# EAGLE design facetHound_inputs_mast_v13 (EAGLE 9.6.2)

## Sheet 1 of 2
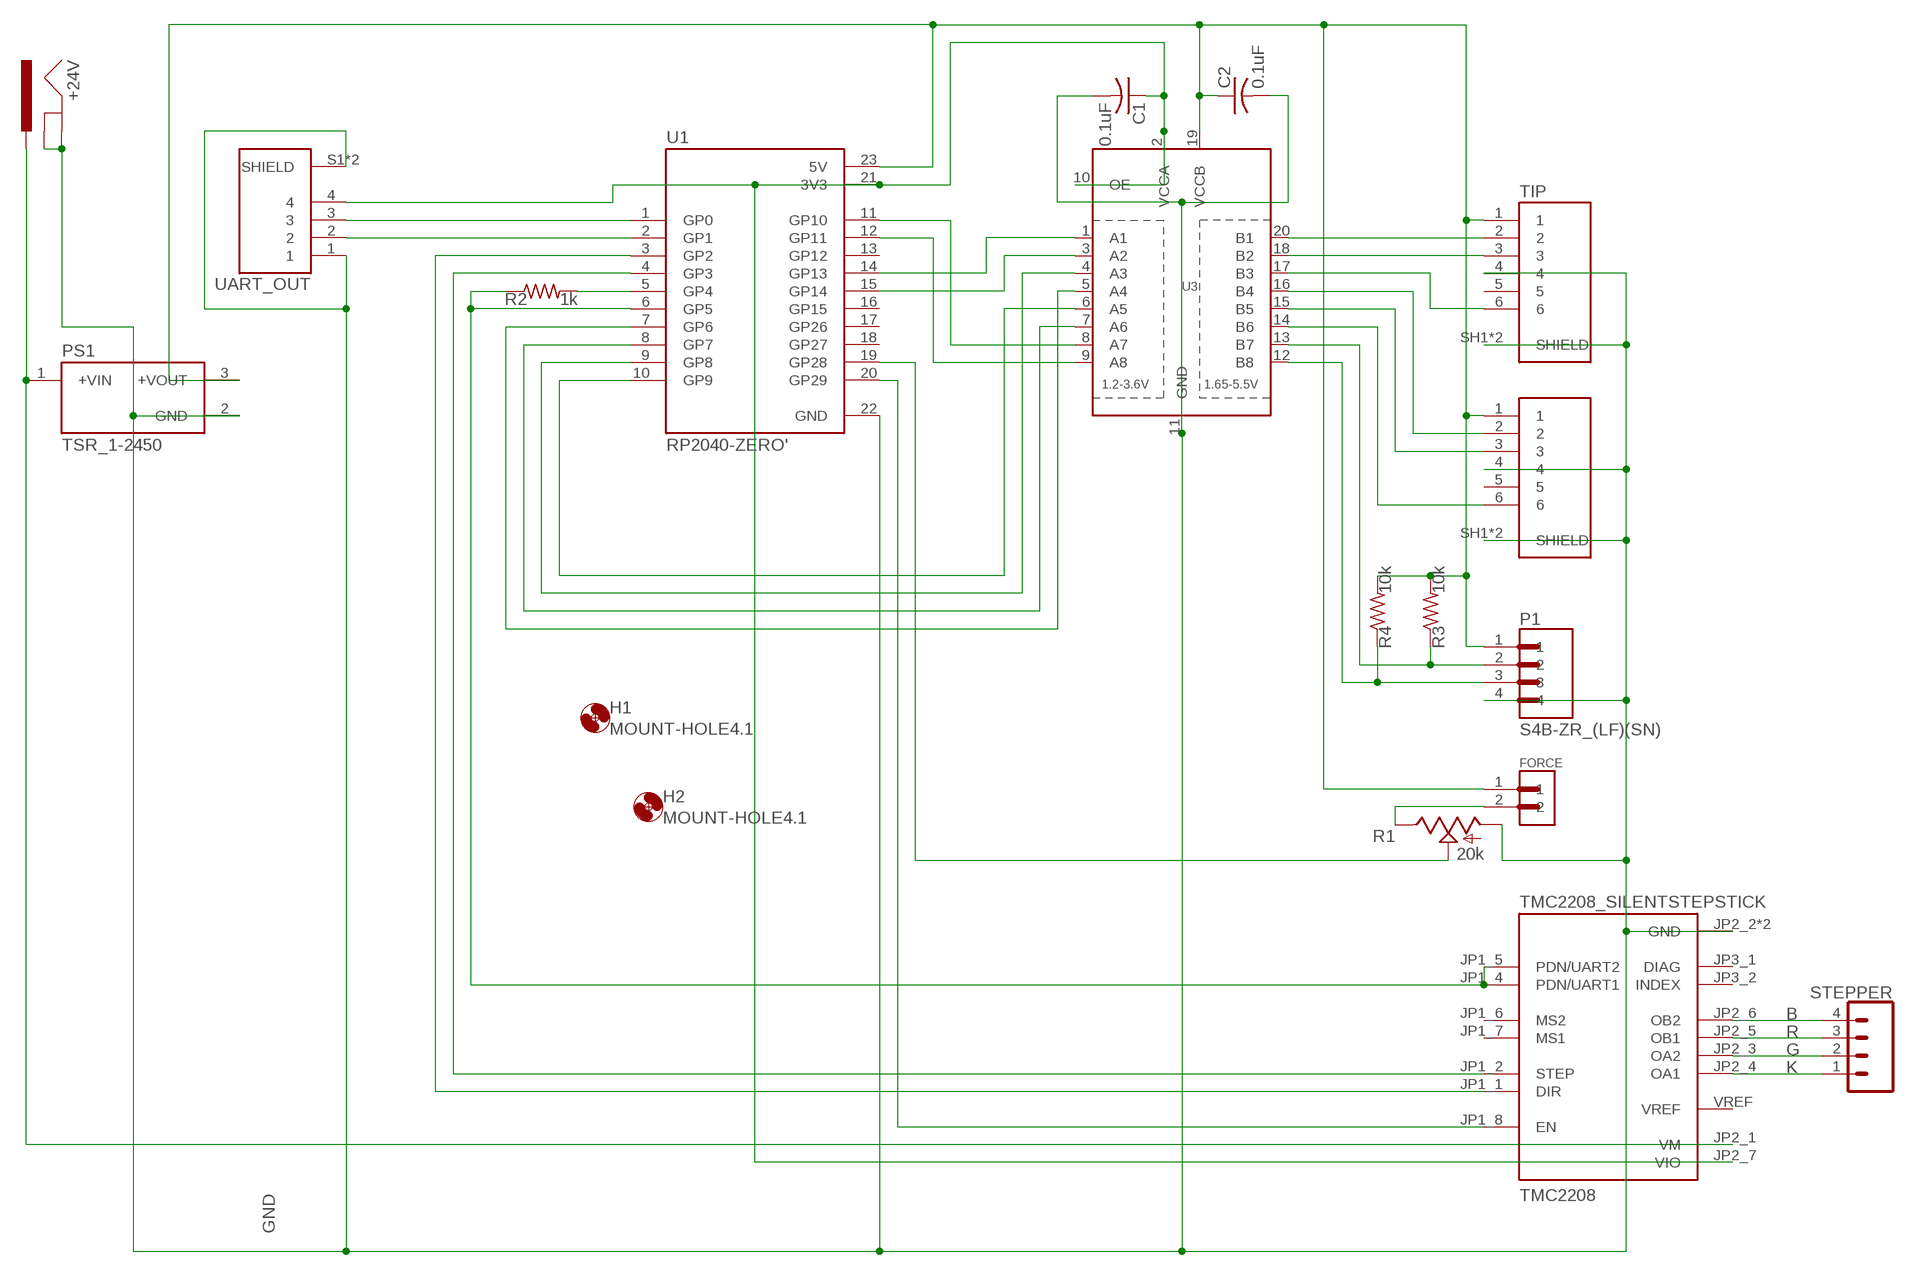
[diagram p0: schematic, sheet 1]

### Parts
+24V  POWER_JACKPOWER_JACK_SLOT  [POWER_JACK_PTH_SLOT]
C1  0.1uF  C-USC1206  [C1206]
C2  0.1uF  C-USC1206  [C1206]
FORCE  S2B-ZR-SM4A-TF  [JST_S2B-ZR-SM4A-TF]
H1  MOUNT-HOLE4.1  [4,1]
H2  MOUNT-HOLE4.1  [4,1]
P1  S4B-ZR_(LF)(SN)  [JST_S4B-ZR(LF)(SN)]
PS1  TSR_1-2450  [CONV_TSR_1-2450]
R1  20k  TRIM_US-RJ9W  [RJ9W]
R2  1k  R-US_R1206  [R1206]
R3  10k  R-US_R1206  [R1206]
R4  10k  R-US_R1206  [R1206]
STEPPER  CONN_04JST-PTH  [JST-4-PTH]
TILT  S6B-ZR-SM4A-TF(LF)(SN)  [JST_S6B-ZR-SM4A-TF(LF)(SN)]
TIP  S6B-ZR-SM4A-TF(LF)(SN)  [JST_S6B-ZR-SM4A-TF(LF)(SN)]
TMC2208  TMC2208_SILENTSTEPSTICK  [MODULE_TMC2208_SILENTSTEPSTICK]
U1  RP2040-ZERO'  [MODULE_RP2040-ZERO]
U3  TXB0108PWR  [TSSOP20]
UART_OUT  S4B-ZR-SM4A-TF(LF)(SN)  [JST_S4B-ZR-SM4A-TF(LF)(SN)]

### Nets
B: STEPPER.4 TMC2208.JP2_6(OB2)
G: STEPPER.2 TMC2208.JP2_3(OA2)
GND: +24V.GND +24V.GNDBREAK C1.2 C2.2 P1.4 PS1.2(GND) R1.A TILT.4 TILT.SH1(SHIELD) TILT.SH2(SHIELD) TIP.4 TIP.SH1(SHIELD) TIP.SH2(SHIELD) TMC2208.JP2_2(GND) TMC2208.JP2_8(GND) U1.22(GND) U3.11(GND) UART_OUT.1 UART_OUT.S1(SHIELD) UART_OUT.S2(SHIELD)
K: STEPPER.1 TMC2208.JP2_4(OA1)
N$1: R2.1 TMC2208.JP1_4(PDN/UART1) TMC2208.JP1_5(PDN/UART2) U1.6(GP5)
N$2: C1.1 TMC2208.JP2_7(VIO) U1.21(3V3) U3.2(VCCA) U3.10(OE) UART_OUT.4
N$3: R2.2 U1.5(GP4)
N$4: TMC2208.JP1_2(STEP) U1.4(GP3)
N$5: TMC2208.JP1_1(DIR) U1.3(GP2)
N$6: C2.1 FORCE.1 P1.1 PS1.3(+VOUT) R3.2 R4.2 TILT.1 TIP.1 U1.23(5V) U3.19(VCCB)
N$7: R1.S U1.19(GP28)
N$8: TIP.2 U3.20(B1)
N$10: U1.2(GP1) UART_OUT.2
N$11: U1.1(GP0) UART_OUT.3
N$12: TIP.3 U3.18(B2)
N$13: TIP.6 U3.17(B3)
N$14: TILT.2 U3.16(B4)
N$15: TILT.3 U3.15(B5)
N$16: TILT.6 U3.14(B6)
N$17: P1.2 R3.1 U3.13(B7)
N$18: P1.3 R4.1 U3.12(B8)
N$20: TMC2208.JP1_8(EN) U1.20(GP29)
N$21: +24V.PWR PS1.1(+VIN) TMC2208.JP2_1(VM)
N$23: U1.14(GP13) U3.1(A1)
N$24: FORCE.2 R1.E
N$25: U1.15(GP14) U3.3(A2)
N$26: U1.9(GP8) U3.4(A3)
N$27: U1.7(GP6) U3.5(A4)
N$28: U1.10(GP9) U3.6(A5)
N$29: U1.8(GP7) U3.7(A6)
N$30: U1.12(GP11) U3.9(A8)
N$31: U1.11(GP10) U3.8(A7)
R: STEPPER.3 TMC2208.JP2_5(OB1)
Unconnected: TILT.5 TIP.5 TMC2208.JP1_6(MS2) TMC2208.JP1_7(MS1) TMC2208.JP3_1(DIAG) TMC2208.JP3_2(INDEX) TMC2208.VREF U1.13(GP12) U1.16(GP15) U1.17(GP26) U1.18(GP27)

## Sheet 2 of 2

## Library data of the parts
+24V = SparkFun-Connectors:POWER_JACK: Power Jack Connector This is the standard 5.5mm barrel jack for power. The PTH is the most common, proven, reliable, footprint. The Slot footprint only works if the mill layer is transmitted to the PCB fab house so be warned. Here are the connectors we sell at SparkFun: DC Barrel Power Jack/Connector <https://www.sparkfun.com/products/119> (PRT-00119) DC Barrel Power Jack/Connector (SMD) <https://www.sparkfun.com/products/12748> (PRT-12748) DC Barrel Jack Adapter - Breadboard Compatible <https://www.sparkfun.com/products/10811> (PRT-10811) It is used on this SparkFun product (and many, many others): SparkFun RedBoard - Programmed with Arduino <https://www.sparkfun.com/products/12757> (DEV-12757) Also, if you need a mating power supply or connector, please check these out: Wall Adapter Power Supply - 9VDC 650mA <https://www.sparkfun.com/products/298> (TOL-00298) DC Barrel Jack Adapter - Male <https://www.sparkfun.com/products/10287> (PRT-10287); PROD_ID: CONN-08197
C1 C2 = adafruit:C-US: CAPACITOR, American symbol
FORCE = S2B-ZR-SM4A-TF:S2B-ZR-SM4A-TF: Check availability <https://pricing.snapeda.com/parts/S2B-ZR-SM4A-TF/JST%20Sales/view-part?ref=eda>; AVAILABILITY: In Stock; CHECK_PRICES: https://www.snapeda.com/parts/S2B-ZR-SM4A-TF/JST/view-part/?ref=eda; DESCRIPTION: Connector Header Surface Mount, Right Angle 2 position 0.059 (1.50mm); MF: JST Sales; MP: S2B-ZR-SM4A-TF; PACKAGE: None; PRICE: None; SNAPEDA_LINK: https://www.snapeda.com/parts/S2B-ZR-SM4A-TF/JST/view-part/?ref=snap
H1 H2 = holes:MOUNT-HOLE: MOUNTING HOLE with drill center marker
P1 = S4B-ZR__LF__SN_:S4B-ZR_(LF)(SN): Check availability <https://pricing.snapeda.com/parts/S4B-ZR%20%28LF%29%28SN%29/JST%20Sales/view-part?ref=eda>; AVAILABILITY: In Stock; CHECK_PRICES: https://www.snapeda.com/parts/S4B-ZR%20(LF)(SN)/JST/view-part/?ref=eda; DESCRIPTION: Connector Header Surface Mount, Right Angle 4 position 0.059 (1.50mm); MF: JST Sales; MP: S4B-ZR (LF)(SN); PACKAGE: None; PRICE: None; SNAPEDA_LINK: https://www.snapeda.com/parts/S4B-ZR%20(LF)(SN)/JST/view-part/?ref=snap
PS1 = TSR_1-2450:TSR_1-2450; MANUFACTURER: Traco Power; MAXIMUM_PACKAGE_HEIGHT: 10.6mm; PARTREV: Apr 27, 2020; STANDARD: Manufacturer Recommendations
R1 = pot:TRIM_US-: POTENTIOMETER
R2-R4 = adafruit:R-US_: RESISTOR, American symbol
STEPPER = SparkFun-Connectors:CONN_04: Multi connection point. Often used as Generic Header-pin footprint for 0.1 inch spaced/style header connections On any of the 0.1 inch spaced packages, you can populate with these: Break Away Headers - Straight <https://www.sparkfun.com/products/116> (PRT-00116) Break Away Male Headers - Right Angle <https://www.sparkfun.com/products/553> (PRT-00553) Female Headers <https://www.sparkfun.com/products/115> (PRT-00115) Break Away Headers - Machine Pin <https://www.sparkfun.com/products/117> (PRT-00117) Break Away Female Headers - Swiss Machine Pin <https://www.sparkfun.com/products/743> (PRT-00743) For SCREWTERMINALS and SPRING TERMINALS visit here: Screw Terimnals on SparkFun.com <https://www.sparkfun.com/search/results?term=Screw+Terminals> (5mm/3.5mm/2.54mm spacing) This device is also useful as a general connection point to wire up your design to another part of your project. Our various solder wires solder well into these plated through hole pads. Hook-Up Wire - Assortment (Stranded, 22 AWG) <https://www.sparkfun.com/products/11375> (PRT-11375) Hook-Up Wire - Assortment (Solid Core, 22 AWG) <https://www.sparkfun.com/products/11367> (PRT-11367) View the entire wire category on our website here <https://www.sparkfun.com/categories/141> Special notes: Molex polarized connector foot print use with SKU : PRT-08231 with associated crimp pins and housings. 1MM SMD Version SKU: PRT-10208; PROD_ID: WIRE-13531; SF_ID: PRT-09916
TILT TIP = S6B-ZR-SM4A-TF_LF__SN_:S6B-ZR-SM4A-TF(LF)(SN): Check availability <https://pricing.snapeda.com/parts/S6B-ZR-SM4A-TF%28LF%29%28SN%29/JST%20Sales%20America%20Inc./view-part?ref=eda>; AVAILABILITY: In Stock; CHECK_PRICES: https://www.snapeda.com/parts/S6B-ZR-SM4A-TF(LF)(SN)/JST/view-part/?ref=eda; DESCRIPTION: Connector Header Surface Mount, Right Angle 6 position 0.059 (1.50mm); MF: JST Sales America Inc.; MP: S6B-ZR-SM4A-TF(LF)(SN); PACKAGE: None; PRICE: None; SNAPEDA_LINK: https://www.snapeda.com/parts/S6B-ZR-SM4A-TF(LF)(SN)/JST/view-part/?ref=snap
TMC2208 = TMC2208_SILENTSTEPSTICK:TMC2208_SILENTSTEPSTICK: Check availability <https://pricing.snapeda.com/parts/TMC2208%20SILENTSTEPSTICK/Trinamic%20Motion/view-part?ref=eda>; AVAILABILITY: In Stock; CHECK_PRICES: https://www.snapeda.com/parts/TMC2208%20SILENTSTEPSTICK/Trinamic/view-part/?ref=eda; DESCRIPTION: TMC2208 Motor Controller/Driver, Stepper Power Management Evaluation Board; MF: Trinamic Motion; MP: TMC2208 SILENTSTEPSTICK; PACKAGE: None; PRICE: None; SNAPEDA_LINK: https://www.snapeda.com/parts/TMC2208%20SILENTSTEPSTICK/Trinamic/view-part/?ref=snap
U1 = RP2040-ZERO:RP2040-ZERO: Check availability <https://pricing.snapeda.com/parts/RP2040-ZERO/Waveshare%20Electronics/view-part?ref=eda>; AVAILABILITY: Not in stock; CHECK_PRICES: https://www.snapeda.com/parts/RP2040-ZERO/Waveshare+Electronics/view-part/?ref=eda; DESCRIPTION: Low-Cost, High-Performance Pico-Like MCU Board Based On Raspberry Pi Microcontroller RP2040; MF: Waveshare Electronics; MP: RP2040-ZERO; PACKAGE: Package; PRICE: None; SNAPEDA_LINK: https://www.snapeda.com/parts/RP2040-ZERO/Waveshare+Electronics/view-part/?ref=snap
U3 = adafruit:TXB0108PWR: 8-Bit Bi-Directional Level Shifter 1.2V-3.6V (VCCA) to 1.65V-5.5V (VCCB) bi-directional level shifter with auto direction sensing. Max data rate - VCCA 1.8V: 20Mbps (50ns), VCCA 3.3V: 100Mbps (10ns) Digikey: 296-21527-1-ND
UART_OUT = S4B-ZR-SM4A-TF_LF__SN_:S4B-ZR-SM4A-TF(LF)(SN): Check availability <https://pricing.snapeda.com/parts/S4B-ZR-SM4A-TF%28LF%29%28SN%29/JST%20Sales/view-part?ref=eda>; AVAILABILITY: In Stock; CHECK_PRICES: https://www.snapeda.com/parts/S4B-ZR-SM4A-TF(LF)(SN)/JST/view-part/?ref=eda; DESCRIPTION: Connector Header Surface Mount, Right Angle 4 position 0.059 (1.50mm); MF: JST Sales; MP: S4B-ZR-SM4A-TF(LF)(SN); PACKAGE: None; PRICE: None; SNAPEDA_LINK: https://www.snapeda.com/parts/S4B-ZR-SM4A-TF(LF)(SN)/JST/view-part/?ref=snap

## Board
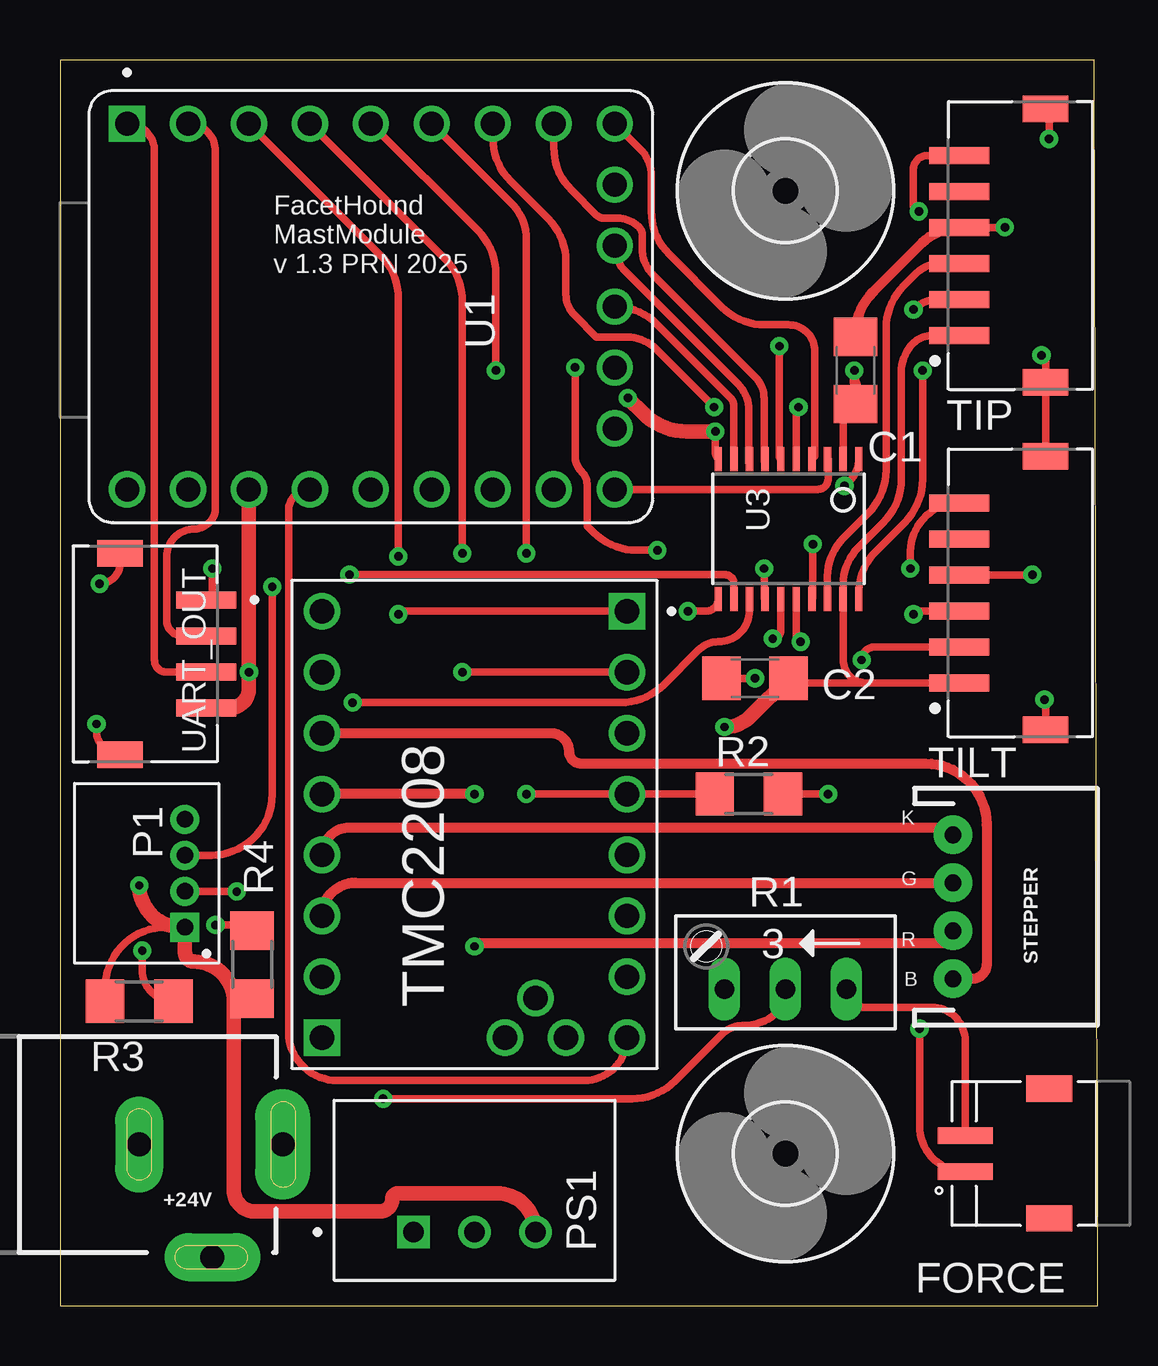
[diagram p1: board, top side]
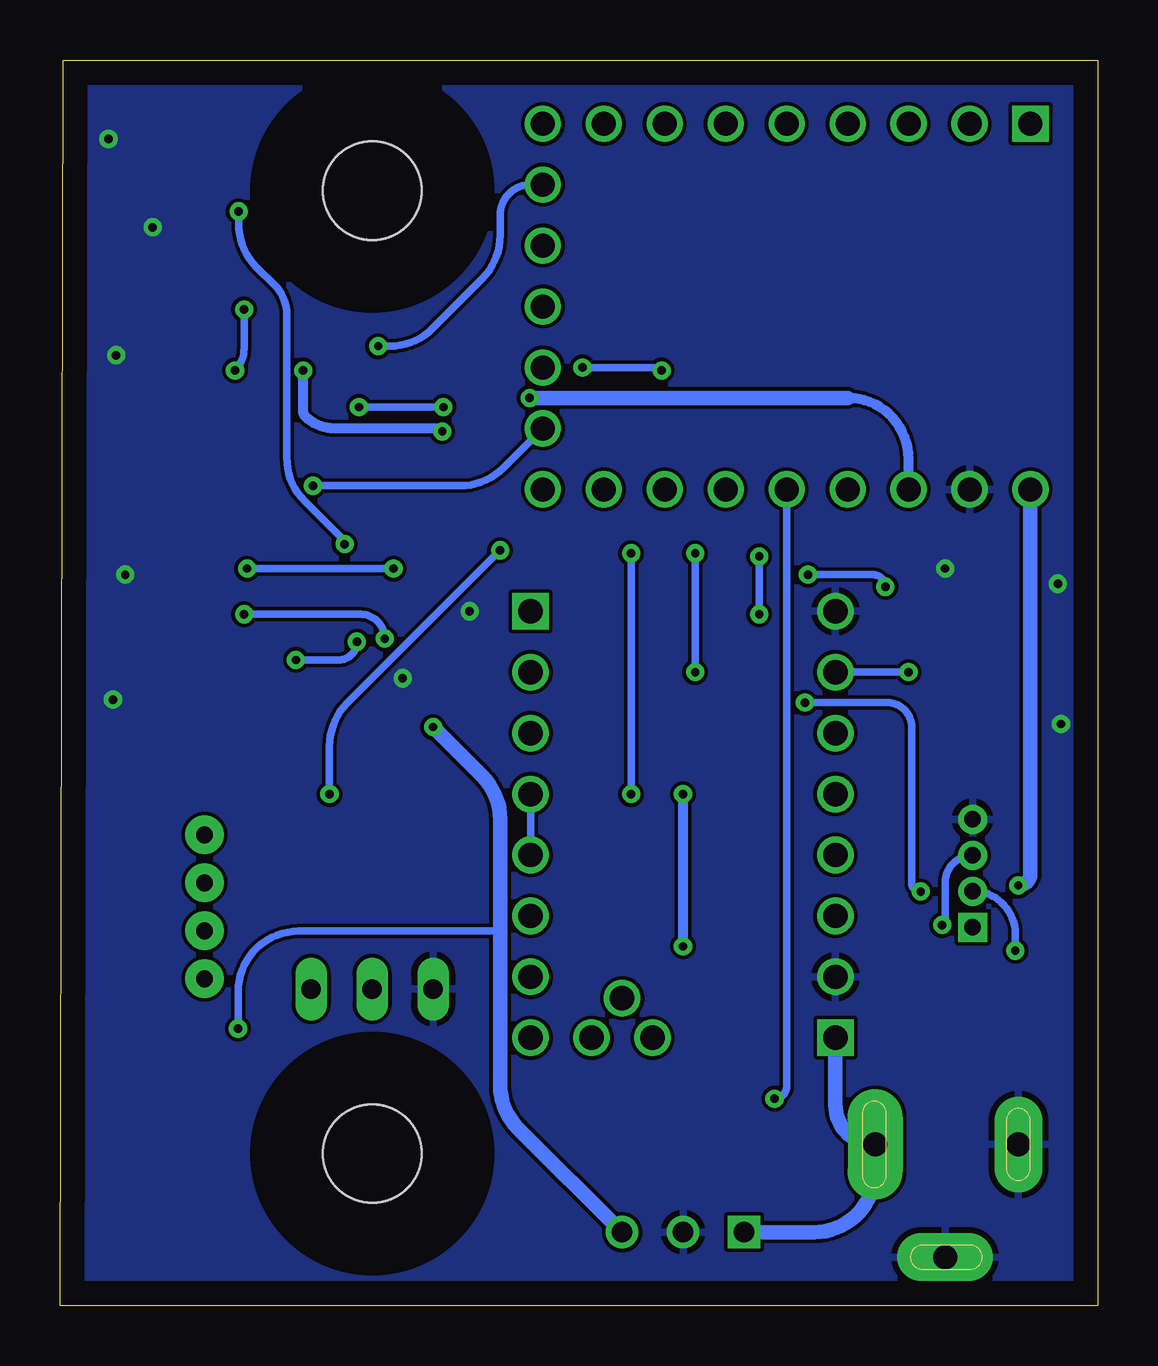
[diagram p2: board, bottom side, seen from below]

Size 43.23 x 51.93 mm. Coordinates in mm from the lower left corner, seen from the top.
Outline: 0,0 43.23,0 43.1,51.93 0,51.93 0,0
Copper layers (1*16): Top 0.035mm / dielectric 1.5mm / Bottom 0.035mm
Design rules "default": minimum track width 6mil, minimum drill 0.35mm, track to track 6mil, track to pad 6mil, pad to pad 6mil, via to via 6mil, smd to smd 6mil, copper to edge 40mil, drill to drill 6mil, minimum pad ring 10mil, minimum via ring 8mil, stop-mask expansion 4mil, vias tented up to drill 0mil, thermal gap 10mil

### Footprints (pad centres in the part's own frame; a part is rotated, then mirrored left to right if it is on the bottom)
POWER_JACK_PTH_SLOT = drill 1 pad 2 long: GND 0,0; GNDBREAK -3.048,4.699 | drill 1 pad 2.3 long: PWR -5.969,0
C1206 = smd 1.6 x 1.8: 1 -1.4,0; 2 1.4,0
JST_S2B-ZR-SM4A-TF = smd 0.7 x 2.3: 1 0.75,0; 2 -0.75,0 | smd 1.1 x 1.9: P1 2.7,3.5; P2 -2.7,3.5
4,1 = hole 4.1: 0,0
JST_S4B-ZR(LF)(SN) = drill 0.7 square: 1 -2.25,0 | drill 0.7: 2 -0.75,0; 3 0.75,0; 4 2.25,0
CONV_TSR_1-2450 = drill 0.85 square: 1 -2.54,-1.75 | drill 0.85: 2 0,-1.75; 3 2.54,-1.75
RJ9W = drill 0.813 long: A 2.54,0.635; E -2.54,0.635; S 0,0.635
R1206 = smd 1.6 x 1.803: 1 -1.422,0; 2 1.422,0
JST-4-PTH = drill 0.7 pad 1.6: 1 -3,0; 2 -1,0; 3 1,0; 4 3,0
JST_S6B-ZR-SM4A-TF(LF)(SN) = smd 0.7 x 2.5: 1 -3.75,0; 2 -2.25,0; 3 -0.75,0; 4 0.75,0; 5 2.25,0; 6 3.75,0 | smd 1.1 x 1.9: SH1 -5.7,-3.6; SH2 5.7,-3.6
MODULE_TMC2208_SILENTSTEPSTICK = drill 1.016 square: JP1_1 6.35,8.89; JP2_1 -6.35,-8.89 | drill 1.016: JP1_2 6.35,6.35; JP1_3 6.35,3.81; JP1_4 6.35,1.27; JP1_5 6.35,-1.27; JP1_6 6.35,-3.81; JP1_7 6.35,-6.35; JP1_8 6.35,-8.89; JP2_2 -6.35,-6.35; JP2_3 -6.35,-3.81; JP2_4 -6.35,-1.27; JP2_5 -6.35,1.27; JP2_6 -6.35,3.81; JP2_7 -6.35,6.35; JP2_8 -6.35,8.89; JP3_1 1.27,-8.89; JP3_2 3.81,-8.89; VREF 2.54,-7.239
MODULE_RP2040-ZERO = drill 1 square: 1 7.62,10.16 | drill 1: 2 7.62,7.62; 3 7.62,5.08; 4 7.62,2.54; 5 7.62,0; 6 7.62,-2.54; 7 7.62,-5.08; 8 7.62,-7.62; 9 7.62,-10.16; 10 5.08,-10.16; 11 2.54,-10.16; 12 0,-10.16; 13 -2.54,-10.16; 14 -5.08,-10.16; 15 -7.62,-10.16; 16 -7.62,-7.62; 17 -7.62,-5.08; 18 -7.62,-2.54; 19 -7.62,0; 20 -7.62,2.54; 21 -7.62,5.08; 22 -7.62,7.62; 23 -7.62,10.16
TSSOP20 = smd 0.305 x 0.991: 1 -2.925,-2.918; 2 -2.275,-2.918; 3 -1.625,-2.918; 4 -0.975,-2.918; 5 -0.325,-2.918; 6 0.325,-2.918; 7 0.975,-2.918; 8 1.625,-2.918; 9 2.275,-2.918; 10 2.925,-2.918; 11 2.925,2.918; 12 2.275,2.918; 13 1.625,2.918; 14 0.975,2.918; 15 0.325,2.918; 16 -0.325,2.918; 17 -0.975,2.918; 18 -1.625,2.918; 19 -2.275,2.918; 20 -2.925,2.918
JST_S4B-ZR-SM4A-TF(LF)(SN) = smd 0.7 x 2.5: 1 -2.25,0; 2 -0.75,0; 3 0.75,0; 4 2.25,0 | smd 1.1 x 1.9: S1 -4.2,-3.6; S2 4.2,-3.6

### Placement (x,y rotation side)
+24V  3.3,6.73 180 top
C1  33.15,38.99 90 top
C2  28.96,26.16 180 top
FORCE  37.72,6.35 270 top
H1  30.23,6.35 0 top
H2  30.23,46.48 0 top
P1  5.21,18.03 90 top
PS1  17.27,4.83 0 top
R1  30.23,13.84 180 top
R2  28.7,21.34 0 top
R3  3.3,12.7 180 top
R4  8,14.22 270 top
STEPPER  37.21,16.64 270 top
TILT  37.46,29.72 90 top
TIP  37.46,44.2 90 top
TMC2208  17.27,20.07 0 top
U1  12.95,41.66 90 top
U3  30.35,32.38 180 top
UART_OUT  6.1,27.18 270 top

### Tracks (layer width: path | path; a pad name or v marks a point on that pad's centre or on a via)
B
  Top 0.406: STEPPER.4 38.02,13.64 arc90 38.61,14.22 38.61,20.07 arc90 36.07,22.61 21.72,22.61 arc-90 21.21,23.11 arc90 20.45,23.88 TMC2208.JP2_6
G
  Top 0.406: TMC2208.JP2_3 arc-90 12.3,17.64 STEPPER.2
GND  (via drill 0.35)
  Top 0.305: TIP.SH2 arc-90 41.21,49.75 v41.21,48.64 | v40.89,39.62 arc-90 41.06,39.45 TIP.SH1 TILT.SH2 | TIP.4 39.36,44.95 arc90 v39.37,44.96 | TILT.4 v40.5,30.47 arc90 v40.51,30.48 | TILT.SH1 41.06,25.23 arc90 v41.02,25.27 | UART_OUT.1 6.35,29.68 v6.35,30.73 | UART_OUT.S1 2.5,30.94 arc-90 v1.65,30.1 | UART_OUT.S2 arc-90 1.52,23.95 v1.52,24.26 | U3.11 arc-90 26.92,28.96 v26.16,28.96 | C2.2 v28.96,26.16
  Top 0.406: C1.2 33.15,40.48 arc-45 33.89,42.27 35.93,44.31 arc-45 TIP.4
  pour Bottom: 0.76,51.82 42.67,51.82 42.67,50.55 42.67,-0.25 0.76,-0.25 0.76,1.02
K
  Top 0.406: TMC2208.JP2_4 arc-90 12.07,19.94 36.91,19.94 arc-90 STEPPER.1
N$1  (via drill 0.35)
  Top 0.305: R2.1 TMC2208.JP1_4 v19.43,21.34 | U1.6 18.8,45.97 arc-45 19.43,44.45 v19.43,31.37
  Bottom 0.305: v19.43,31.37 v19.43,21.34 | TMC2208.JP1_4 TMC2208.JP1_5
N$2  (via drill 0.35)
  Top 0.305: C1.1 arc90 32.63,37.07 U3.2 | v27.3,36.45 27.3,35.6 arc45 U3.10 | v7.88,26.42 v7.87,26.42
  Top 0.406: C1.1 33.15,38.45 arc-45 33.1,38.56 v33.1,38.99
  Top 0.61: U1.21 v7.87,26.42 7.87,25.76 arc-45 7.62,25.15 arc-45 7.09,24.93 UART_OUT.4 | v23.66,37.85 24.31,37.19 arc45 26.11,36.45 v27.3,36.45
  Bottom 0.305: TMC2208.JP2_7 v7.88,26.42
  Bottom 0.406: U1.21 7.87,35.31 arc-90 10.41,37.85 | v33.1,38.99 33.1,37.27 arc-45 33.02,37.08 arc-45 31.79,36.58 27.61,36.58 arc45 v27.3,36.45
  Bottom 0.61: 10.41,37.85 v23.66,37.85
N$3  (via drill 0.35)
  Top 0.305: U1.5 17.42,44.81 arc-45 18.16,43.02 v18.16,38.99 | v21.46,39.12 21.46,35.41 arc45 21.72,34.8 arc-45 21.97,34.19 21.97,32.51 22.24,32.24 arc45 24.04,31.5 v24.89,31.5 | v32,21.34 R2.2
  Bottom 0.305: v18.16,38.99 arc-45 18.47,39.12 v21.46,39.12 | v24.89,31.5 31.26,25.13 arc-45 32,23.33 v32,21.34
N$4  (via drill 0.35)
  Top 0.305: U1.4 16.02,43.67 arc-45 16.76,41.87 v16.76,31.37 | v16.76,26.42 TMC2208.JP1_2
  Bottom 0.305: v16.76,31.37 v16.76,26.42
N$5  (via drill 0.35)
  Top 0.305: v14.1,28.83 arc-45 14.4,28.96 TMC2208.JP1_1 | U1.3 13.35,43.8 arc-45 14.1,42 v14.1,31.24
  Bottom 0.305: v14.1,31.24 v14.1,28.83
N$6  (via drill 0.35)
  Top 0.305: U3.19 32.63,29.83 | U3.19 32.63,30.06 arc-45 33.27,31.62 34.31,32.66 arc45 35.05,34.45 35.05,38.91 arc-45 35.56,40.13 arc-45 36.32,40.45 TIP.1 | TILT.1 33.59,25.97 | 33.59,25.97 arc-90 32.64,26.92 U3.19 arc90 U3.19 | R3.2 1.88,13.24 arc-90 4.42,15.78 P1.1 | 33.59,25.97 30.55,25.97 arc-90 C2.1 | FORCE.1 arc-90 35.81,7.5 v35.81,11.56
  Top 0.61: R4.2 arc90 7.24,12.04 | 7.24,12.04 7.24,4.83 arc90 8.13,3.94 13.34,3.94 arc90 13.84,4.45 arc-90 14.1,4.7 18.19,4.7 arc-90 PS1.3 | v3.3,17.53 arc90 5.04,15.78 P1.1 | P1.1 5.21,15.62 | P1.1 5.21,14.73 arc90 5.59,14.35 arc-90 7.24,12.7 7.24,12.04 | v27.69,24.13 arc45 28.78,24.58 C2.1
  Bottom 0.305: v35.81,11.56 35.81,13.08 arc90 33.27,15.62 24.89,15.62
  Bottom 0.61: U1.23 2.79,18.03 arc90 v3.3,17.53 | PS1.3 24.15,7.41 arc45 24.89,9.21 24.89,15.62 24.89,20.28 arc-45 25.64,22.08 v27.69,24.13
N$7  (via drill 0.35)
  Top 0.305: v13.46,8.64 23.84,8.64 arc45 25.64,9.38 27.58,11.33 arc-45 28.45,11.68 arc45 29.97,12.31 29.97,12.32 arc45 30.23,12.93 R1.S
  Bottom 0.305: U1.19 12.95,12.45 12.95,12.19 12.95,9.14 arc90 v13.46,8.64
N$8  (via drill 0.35)
  Top 0.305: 36.61,41.95 TIP.2 36.57,41.95 arc45 v35.56,41.53 | U3.20 33.28,29.69 arc-45 34.02,31.48 35.2,32.66 arc45 35.94,34.45 v35.94,38.99
  Bottom 0.305: v35.94,38.99 arc-45 35.56,39.91 v35.56,41.53
N$10
  Top 0.305: U1.2 arc-90 6.48,48.13 6.48,33.27 arc-90 5.59,32.38 arc90 4.45,31.24 4.45,28.58 arc90 5.08,27.94 6.08,27.94 arc-90 UART_OUT.2
N$11
  Top 0.305: U1.1 arc-90 3.94,48.13 3.94,26.92 arc90 4.45,26.42 UART_OUT.3 arc90 UART_OUT.3
N$12
  Top 0.305: U3.18 31.98,30.41 arc-45 32.64,32 33.67,33.04 arc45 34.42,34.83 34.42,40.73 arc-45 35.16,42.53 35.69,43.05 arc-45 36.64,43.45 TIP.3
N$13  (via drill 0.35)
  Top 0.305: TIP.6 36.13,47.95 arc90 35.56,47.37 35.56,45.85 arc90 v35.79,45.62 | v31.37,31.75 31.37,29.57 arc-45 U3.17
  Bottom 0.305: v35.79,45.62 35.79,45.09 arc-45 35.04,43.3 34.29,42.55 arc45 33.78,41.32 33.78,35.34 arc-45 33.04,33.55 31.46,31.97 arc45 v31.37,31.75
N$14  (via drill 0.35)
  Top 0.305: TILT.2 33.95,27.47 arc90 v33.4,26.92 | v30.86,27.69 arc-90 30.68,27.87 U3.16
  Bottom 0.305: v33.4,26.92 31.62,26.92 arc-90 v30.86,27.69
N$15  (via drill 0.35)
  Top 0.305: TILT.3 35.7,28.97 arc90 v35.56,28.83 | v29.7,27.81 arc90 30.03,28.14 U3.15
  Bottom 0.305: v35.56,28.83 30.71,28.83 arc90 v29.7,27.81
N$16  (via drill 0.35)
  Top 0.305: TILT.6 arc90 35.43,31.44 v35.43,30.73 | v29.34,30.73 29.34,29.51 arc90 U3.14
  Bottom 0.305: v35.43,30.73 v29.34,30.73
N$17  (via drill 0.35)
  Top 0.305: R3.1 arc-90 3.43,14 v3.43,14.81 | v12.19,25.15 23.36,25.15 arc45 25.15,25.89 26.6,27.34 arc-45 27.43,27.69 arc90 28.73,28.98 U3.13 | v7.37,17.27 5.22,17.27 arc-90 P1.2
  Bottom 0.305: v3.43,14.81 3.43,15.5 arc-90 P1.2 | v12.19,25.15 8.76,25.15 arc90 7.75,24.13 7.75,17.65 arc-90 v7.37,17.27
N$18  (via drill 0.35)
  Top 0.305: P1.3 6.3,18.78 arc90 8.84,21.32 v8.84,29.97 | v12.07,30.48 27.43,30.48 27.7,30.48 arc-90 28.08,30.1 U3.12 | v6.48,15.88 7.77,15.88 arc-90 R4.1
  Bottom 0.305: P1.3 arc-90 6.35,17.64 6.35,16 arc90 v6.48,15.88 | v8.84,29.97 arc-90 9.35,30.48 v12.07,30.48
N$20
  Top 0.305: U1.20 arc90 9.52,33.15 9.52,11.43 arc90 11.56,9.4 21.84,9.4 arc90 TMC2208.JP1_8
N$21
  Bottom 0.61: TMC2208.JP2_1 10.92,8.38 arc-90 +24V.PWR 9.27,5.62 arc90 11.81,3.08 PS1.1
N$23  (via drill 0.35)
  Top 0.305: v32.69,34.18 32.9,34.4 arc45 U3.1
  Bottom 0.305: U1.14 24.76,34.93 arc45 26.56,34.18 v32.69,34.18
N$24
  Top 0.305: FORCE.2 37.72,11.05 arc90 36.32,12.45 33.53,12.45 arc-90 R1.E
N$25
  Top 0.305: U3.3 arc-90 32,35.28 32,34.47 arc-45 31.88,34.16 arc-45 31.57,34.04 U1.15
N$26
  Top 0.305: U3.4 31.46,35.43 31.46,39.79 arc90 30.35,40.89 29.37,40.89 arc-45 27.58,41.64 25.38,43.83 arc-45 24.64,45.63 24.64,47.12 arc45 24.19,48.2 U1.9
N$27  (via drill 0.35)
  Top 0.305: U1.7 18.03,48.68 arc45 18.78,46.88 20.34,45.32 arc-45 21.08,43.53 21.08,42.16 arc45 21.44,41.3 22.35,40.39 23.62,40.39 arc-45 24.84,39.88 v27.26,37.46 | U3.5 30.68,37.24 arc-45 v30.77,37.46
  Bottom 0.305: v30.77,37.46 27.43,37.46 27.34,37.46
  Bottom 0.406: 27.43,37.46 v27.26,37.46
N$28  (via drill 0.35)
  Top 0.305: v29.97,40 29.97,35.44 arc45 U3.6
  Bottom 0.305: U1.10 23.62,46.74 arc-90 24.89,45.47 24.89,44.61 arc45 25.64,42.82 27.7,40.75 arc45 29.5,40 v29.97,40
N$29
  Top 0.305: U3.7 arc45 29.34,35.2 29.34,37.81 arc45 28.96,38.73 24.71,42.98 arc-45 24.26,44.07 24.26,44.65 arc45 24.13,44.96 24.11,44.98 arc45 23.24,45.34 22.66,45.34 arc-45 22.35,45.47 21.32,46.5 arc-45 20.57,48.3 U1.8
N$30
  Top 0.305: U1.12 arc-45 24.85,40.94 27.94,37.85 arc-45 28.08,37.51 U3.9
N$31
  Top 0.305: 28.73,35.08 28.73,35.18 | 28.73,35.18 U3.8 | 28.73,35.18 arc90 28.7,35.15 28.7,37.34 arc45 28.25,38.42 23.56,43.11 arc-45 U1.11
R  (via drill 0.35)
  Top 0.406: STEPPER.3 arc-90 36.69,15.11 17.4,15.11 arc90 v17.27,14.99 | v17.27,21.34 TMC2208.JP2_5
  Bottom 0.406: v17.27,14.99 v17.27,21.34

### Text on the board
tNames: FacetHound / MastModule / v 1.3 PRN 2025 | K | G | R | B